# EAGLE design RadioIC (EAGLE 9.6.2)
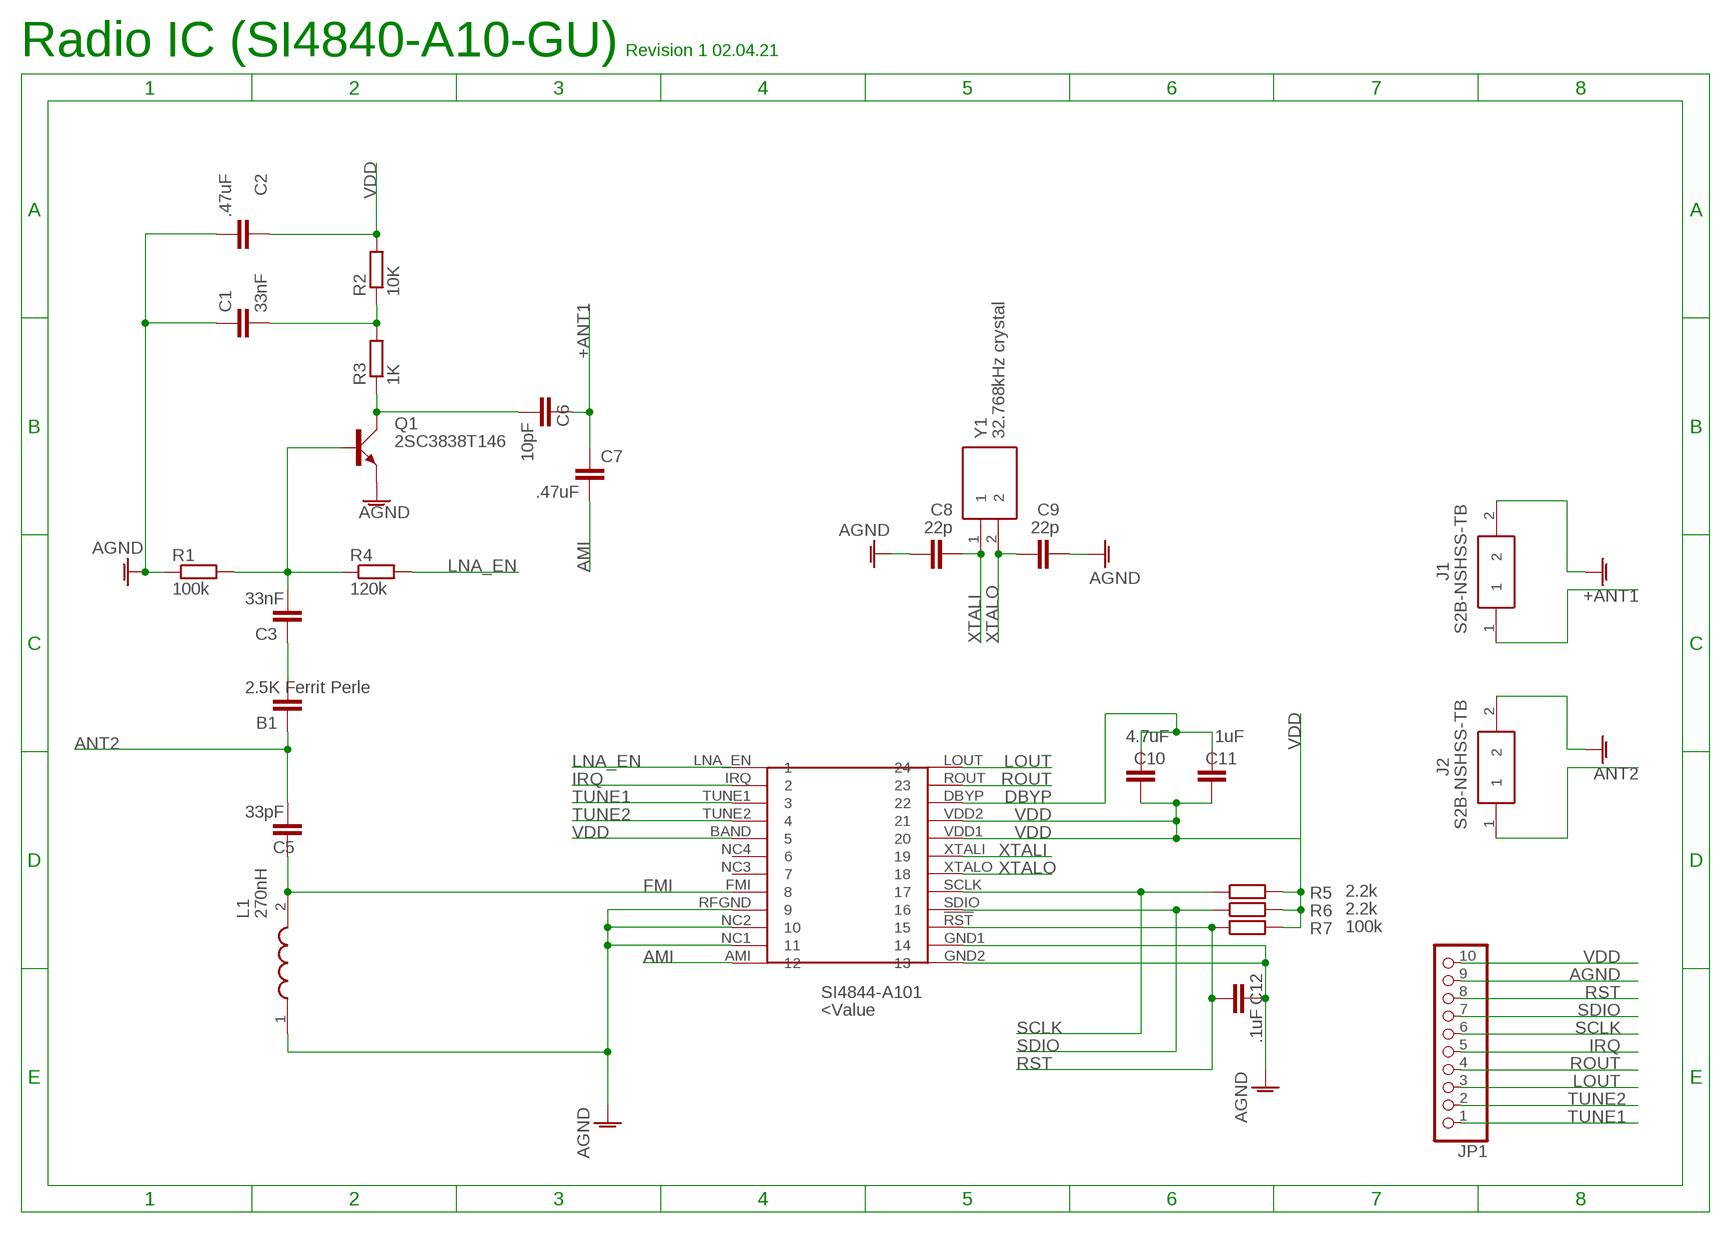
[diagram p0: schematic, sheet 1]

## Parts
B1  2.5K Ferrit Perle  C-EU_805C0805  [C0805]
C1  33nF  CNC5L1X7R1C106K160AEC1206  [C1206]
C2  .47uF  C-EU_805C0805  [C0805]
C3  33nF  C-EU_1206C1206  [C1206]
C5  33pF  C-EU_805C0805  [C0805]
C6  10pF  C-EU_805C0805  [C0805]
C7  .47uF  C-EU_805C0805  [C0805]
C8  22p  C-EU_805C0805  [C0805]
C9  22p  C-EU_805C0805  [C0805]
C10  4.7uF  C-EU_1206C1206  [C1206]
C11  1uF  C-EU_805C0805  [C0805]
C12  .1uF  C-EU_805C0805  [C0805]
J1  S2B-NSHSS-TB  [SM02B-NSHSS-TB]
J2  S2B-NSHSS-TB  [SM02B-NSHSS-TB]
JP1  PINHD-1X10  [1X10]
L1  270nH  LQW2UASR56F0CL  [LQW2UAS12NG00L]
Q1  2SC3838T146  [SC59]
R1  100k  ERJ-PB6B5623VR0805  [R0805]
R2  10K  RCS1206100KJNEAR1206  [R1206]
R3  1K  RCS1206100KJNEAR1206  [R1206]
R4  120k  ERJ-PB6B5623VR0805  [R0805]
R5  2.2k  ERJ-PB6B5623VR0805  [R0805]
R6  2.2k  ERJ-PB6B5623VR0805  [R0805]
R7  100k  ERJ-PB6B5623VR0805  [R0805]
SI4844-A101  SI4840-A10-GU  [SSOP]
Y1  32.768kHz crystal  CM7V-T1A-32.768K-9PF-20PPM-TA-  [CM7VT1A32768KHZ125PF10PPMTBQC]

## Nets
+ANT1: C6.1 C7.1 J1.1
AGND: C1.1 C2.2 C8.1 C9.2 C12.1 J1.2 J2.2 JP1.9 L1.1 Q1.E R1.1 SI4844-A101.GND1 SI4844-A101.GND2 SI4844-A101.NC1 SI4844-A101.NC2 SI4844-A101.RFGND
AMI: C7.2 SI4844-A101.AMI
ANT2: B1.1 C5.2 J2.1
DBYP: C10.2 C11.2 SI4844-A101.DBYP
FMI: C5.1 L1.2 SI4844-A101.FMI
IRQ: JP1.5 SI4844-A101.IRQ
LNA_EN: R4.2 SI4844-A101.LNA_EN
LOUT: JP1.3 SI4844-A101.LOUT
N$3: B1.2 C3.1
N$5: C3.2 Q1.B R1.2 R4.1
N$6: C6.2 Q1.C R3.1
N$7: C1.2 R2.1 R3.2
ROUT: JP1.4 SI4844-A101.ROUT
RST: C12.2 JP1.8 R7.1 SI4844-A101.!RST
SCLK: JP1.6 R5.1 SI4844-A101.SCLK
SDIO: JP1.7 R6.1 SI4844-A101.SDIO
TUNE1: JP1.1 SI4844-A101.TUNE1
TUNE2: JP1.2 SI4844-A101.TUNE2
VDD: C2.1 C10.1 C11.1 JP1.10 R2.2 R5.2 R6.2 R7.2 SI4844-A101.BAND SI4844-A101.VDD1 SI4844-A101.VDD2
XTALI: C8.2 SI4844-A101.XTALI Y1.1
XTALO: C9.1 SI4844-A101.XTALO Y1.2
Unconnected: SI4844-A101.NC3 SI4844-A101.NC4

## Notes on the sheet
- Radio IC (SI4840-A10-GU) | Revision 1 02.04.21

## Library data of the parts
B1 C2 C5-C9 C11 C12 = CommonParts:C-EU_805: CAPACITOR, European symbol; SPICEPREFIX: C
C1 = MouserUseful:CNC5L1X7R1C106K160AE: CAPACITOR, European symbol; MAX: 16V; SPICEPREFIX: C; VALUE: 10uF
C3 C10 = CommonParts:C-EU_1206: CAPACITOR, European symbol; SPICEPREFIX: C
J1 J2 = CommonParts:S2B-NSHSS-TB: NSH 1.0mm SMT shrouded R/A PCB header,2P JST NSH Series, 1mm Pitch 2 Way 1 Row Shrouded Right Angle PCB Header, Surface Mount, Solder Termination Source: Datasheet <http://www.jst-mfg.com/product/pdf/eng/eNSH.pdf>; DESCRIPTION: NSH 1.0mm SMT shrouded R/A PCB header,2P JST NSH Series, 1mm Pitch 2 Way 1 Row Shrouded Right Angle PCB Header, Surface Mount, Solder Termination; HEIGHT: mm; MANUFACTURER_NAME: JST (JAPAN SOLDERLESS TERMINALS); MANUFACTURER_PART_NUMBER: SM02B-NSHSS-TB(LF)(SN)
JP1 = pinhead:PINHD-1X10: PIN HEADER
L1 = MouserUseful:LQW2UASR56F0CL: LQW2UAS_0C Series Inductor 560nH +/-1% 1008 (2520) Source: Datasheet <https://componentsearchengine.com/Datasheets/1/LQW2UASR56F0CL.pdf>; DESCRIPTION: LQW2UAS_0C Series Inductor 560nH +/-1% 1008 (2520); HEIGHT: 2.03mm; MANUFACTURER_NAME: Murata Electronics; MANUFACTURER_PART_NUMBER: LQW2UASR56F0CL; MOUSER_PART_NUMBER: 81-LQW2UASR56F0CL; MOUSER_PRICE-STOCK: https://www.mouser.com/Search/Refine.aspx?Keyword=81-LQW2UASR56F0CL
Q1 = transistor-small-signal:2SC3838: High-Frequency Amplifier Transistor 11V, 50mA, 3.2GHz (Rohm)
R1 R4-R7 = MouserUseful:ERJ-PB6B5623V: RESISTOR, European symbol; VALUE: 562kOhm
R2 R3 = MouserUseful:RCS1206100KJNEA: RESISTOR, European symbol; SPICEPREFIX: R; VALUE: 100kOhm; WATT: 0.5
SI4844-A101 = MouserUseful:SI4840-A10-GU
Y1 = MouserUseful:CM7V-T1A-32.768K-9PF-20PPM-TA-: Crystals 32.768 kHz 9.0 pF +/-20 PPM AEC-Q200 Source: Datasheet <https://componentsearchengine.com/Datasheets/1/CM7V-T1A-32.768k-9pF-20PPM-TA-QA T3.pdf>; DESCRIPTION: Crystals 32.768 kHz 9.0 pF +/-20 PPM AEC-Q200; HEIGHT: 0.65mm; MANUFACTURER_NAME: MICRO CRYSTAL; MANUFACTURER_PART_NUMBER: CM7V-T1A-32.768k-9pF-20PPM-TA-QA T3; MOUSER_PART_NUMBER: 428-201568-MG03; MOUSER_PRICE-STOCK: https://www.mouser.com/Search/Refine.aspx?Keyword=428-201568-MG03

## Net classes
0 default: clearance 0.205 mm
1 other: width 0.2 mm, drill 0.2 mm, clearance 0.205 mm to class 0, clearance 0.205 mm

## Board
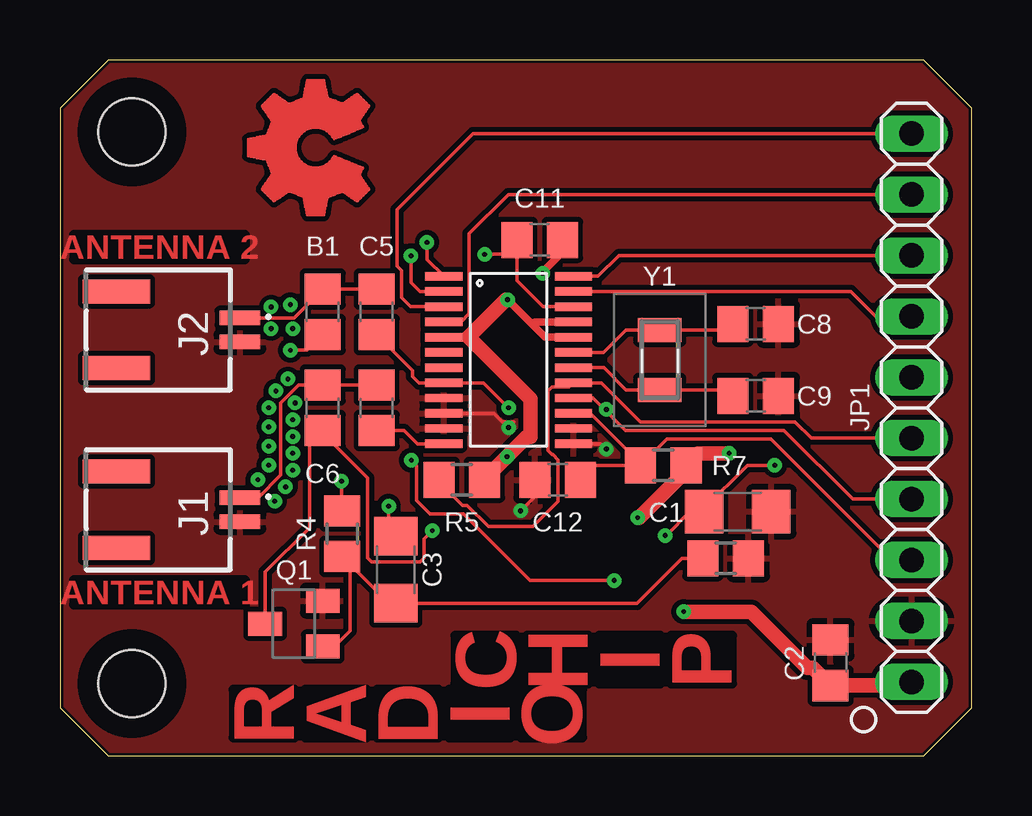
[diagram p1: board, top side]
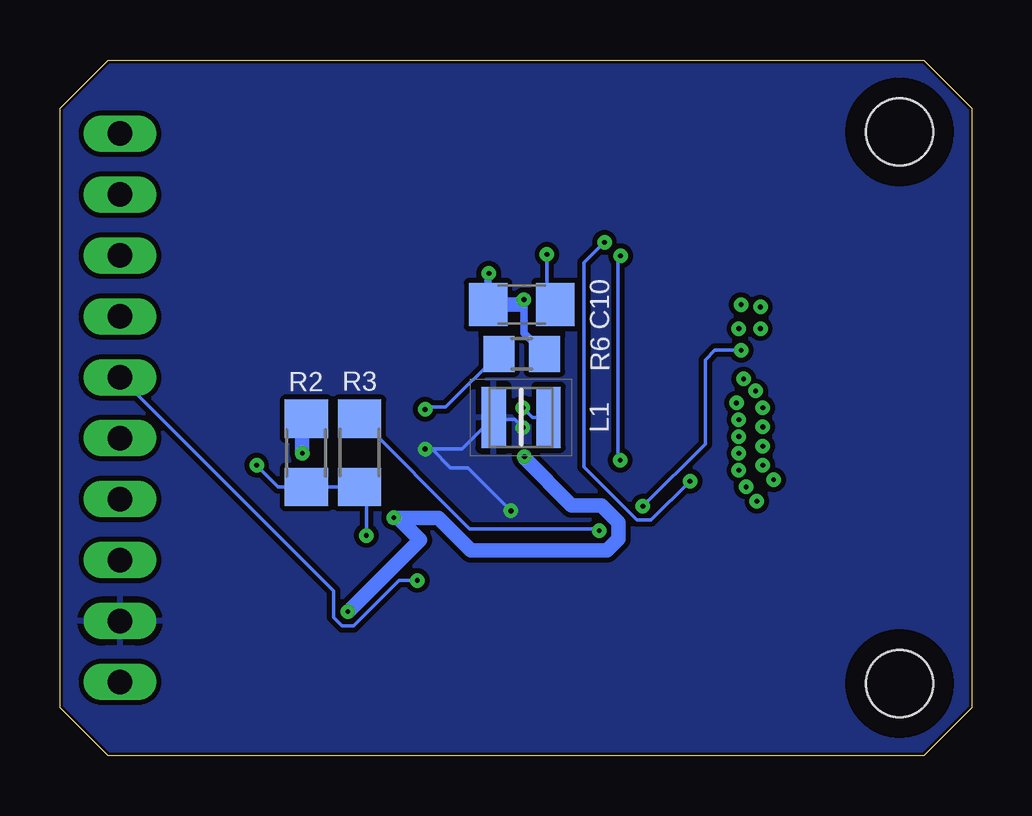
[diagram p2: board, bottom side, seen from below]

Size 38 x 29 mm. Coordinates in mm from the lower left corner, seen from the top.
Outline: 2,0 36,0 38,2 38,27 36,29 2,29 0,27 0,2 2,0
Copper layers (1*16): Top 0.035mm / dielectric 1.5mm / Bottom 0.035mm
Design rules "default *": minimum track width 6mil, minimum drill 0.2mm, track to track 6mil, track to pad 6mil, pad to pad 6mil, via to via 6mil, smd to smd 6mil, copper to edge 5mil, drill to drill 6mil, minimum pad ring 10mil, minimum via ring 8mil, stop-mask expansion 0mil, vias tented up to drill 0mil, thermal gap 10mil
Holes 2.8 mm at 3,3 3,26
tRestrict: area 2,25 to 4,27; area 2,2 to 4,4
bRestrict: area 2,2 to 4,4; area 2,25 to 4,27

### Footprints (pad centres in the part's own frame; a part is rotated, then mirrored left to right if it is on the bottom)
C0805 = smd 1.3 x 1.5: 1 -0.95,0; 2 0.95,0
C1206 = smd 1.6 x 1.8: 1 -1.4,0; 2 1.4,0
SM02B-NSHSS-TB = smd 0.6 x 1.7: 1 1,0; 2 0,0 | smd 1 x 2.8: 3 -1.1,5.15; 4 2.1,5.15
1X10 = drill 1.016 long: 1 -11.43,0; 2 -8.89,0; 3 -6.35,0; 4 -3.81,0; 5 -1.27,0; 6 1.27,0; 7 3.81,0; 8 6.35,0; 9 8.89,0; 10 11.43,0
LQW2UAS12NG00L = smd 1.015 x 2.54: 1 -1.143,0; 2 1.143,0
SC59 = smd 1 x 1.4: B -0.95,-1.2; C 0,1.2; E 0.95,-1.2
R0805 = smd 1.3 x 1.5: 1 -0.95,0; 2 0.95,0
R1206 = smd 1.6 x 1.803: 1 -1.422,0; 2 1.422,0
SSOP = smd 1.55 x 0.35: !RST 5.4,1.27; AMI 0,0; BAND 0,4.445; DBYP 5.4,5.715; FMI 0,2.54; GND1 5.4,0.635; GND2 5.4,0; IRQ 0,6.35; LNA_EN 0,6.985; LOUT 5.4,6.985; NC1 0,0.635; NC2 0,1.27; NC3 0,3.175; NC4 0,3.81; RFGND 0,1.905; ROUT 5.4,6.35; SCLK 5.4,2.54; SDIO 5.4,1.905; TUNE1 0,5.715; TUNE2 0,5.08; VDD1 5.4,4.445; VDD2 5.4,5.08; XTALI 5.4,3.81; XTALO 5.4,3.175
CM7VT1A32768KHZ125PF10PPMTBQC = smd 1 x 1.8: 1 -1.25,0; 2 1.25,0

### Placement (x,y rotation side)
B1  10.95,18.5 270 top
C1  28.25,10.17 180 top
C2  32.12,3.87 90 top
C3  14,7.75 270 top
C5  13.2,18.5 90 top
C6  10.95,14.5 270 top
C7  13.2,14.5 270 top
C8  29,18 180 top
C9  29,15 0 top
C10  18.75,18.8 0 bottom
C11  20,21.5 180 top
C12  20.75,11.5 0 top
J1  7.5,9.75 90 top
J2  7.5,17.25 90 top
JP1  35.5,14.5 270 top
L1  18.78,14.1 0 bottom
Q1  9.75,5.5 90 top
R1  27.75,8.22 180 top
R2  27.73,12.62 90 bottom
R3  25.51,12.62 270 bottom
R4  11.77,9.25 90 top
R5  16.75,11.5 0 top
R6  18.75,16.75 0 bottom
R7  25.15,12.1 0 top
SI4844-A101  16,13 0 top
Y1  25,16.5 270 top

### Tracks (layer width: path | path; a pad name or v marks a point on that pad's centre or on a via)
+ANT1
  Top 0.152: C7.1 C6.1 9.95,15.45 9.2,14.7 9.2,11.7 8.25,10.75 J1.1
AGND  (via drill 0.2 pad 0.35)
  Top 0.152: SI4844-A101.GND2 22.56,13 v22.78,12.78 | SI4844-A101.NC2 18.1,14.27 18.46,13.92 18.93,13.92 18.93,13.9 v18.7,13.67 | v19.2,10.2 19.8,10.8 C12.1
  Bottom 0.152: v22.78,12.78 22.5,12.78 | 22.5,12.78 21.25,12.78 20.01,14.01 | 20.01,14.01 L1.1 | v18.7,13.67 19.04,14.01 20.01,14.01 | v19.2,10.2 21,12 21.72,12 22.5,12.78
  pour Top: 0,2 0,27 2,29 36,29 38,27 38,2 36,0 2,0
  pour Bottom: 0,2 0,27 2,29 36,29 38,27 38,2 36,0 2,0
AMI
  Top 0.152: C7.2 14.35,13.55 14.9,13 SI4844-A101.AMI
ANT2
  Top 0.152: J2.1 9.75,18.25 B1.1 C5.2
DBYP  (via drill 0.2)
  Top 0.152: v17.7,20.9 18.45,20.9 C11.2 19.05,19.8 20.14,18.71 SI4844-A101.DBYP
  Bottom 0.152: v17.7,20.9 17.7,19.15 C10.2
FMI  (via drill 0.2)
  Top 0.152: C5.1 14.7,16.05 14.7,15.8 14.96,15.54 SI4844-A101.FMI 17.66,15.54 v18.7,14.5
  Bottom 0.152: L1.2 18.3,14.1 v18.7,14.5
IRQ  (via drill 0.2, 0.2 pad 0.35)
  Top 0.152: v14.64,12.31 14.87,12.08 14.87,10.63 15.43,10.07 16.83,10.07 19.6,7.3 v23.1,7.3 | v14.63,20.83 14.63,19.72 15,19.35 SI4844-A101.IRQ
  Bottom 0.152: v14.64,12.31 14.73,12.4 14.73,20.73 v14.63,20.83 | v23.1,7.3 23.87,7.3 25.76,5.41 26.24,5.41 26.59,5.76 26.59,6.86 JP1.5
LNA_EN  (via drill 0.2)
  Top 0.152: SI4844-A101.LNA_EN 15.3,20.68 v15.3,21.4 | R4.2 11.74,10.23 v11.74,11.44
  Bottom 0.152: v11.74,11.44 13.36,9.82 13.94,9.82 16.15,12.02 16.15,20.55 v15.3,21.4
LOUT
  Top 0.152: JP1.3 23.3,20.85 22.43,19.98 SI4844-A101.LOUT
N$1  (via drill 0.2 pad 0.35)
  other vias: 8.8,18.7
N$2  (via drill 0.2 pad 0.35)
  other vias: 9.6,18.8
N$3  (via drill 0.2)
  Top 0.152: C3.1 13.7,9.45 v13.7,10.4 | B1.2 10.3,16.9 v9.6,16.9
  Bottom 0.152: v13.7,10.4 11.1,13 11.1,16.5 10.7,16.9 v9.6,16.9
N$4  (via drill 0.2 pad 0.35)
  other vias: 9.7,17.8
N$5
  Top 0.152: R1.2 25.92,8.22 24.05,6.35 C3.2 13.72,6.35 R4.1 12.1,7.97 12.1,5.2 11.45,4.55 Q1.B
N$6  (via drill 0.2)
  Top 0.152: Q1.C 8.55,7.65 10.4,9.5 10.4,13 10.9,13.5 | 10.9,13.5 C6.2 | v15.53,9.38 15.18,9.03 15.18,8.23 15.02,8.07 12.98,8.07 12.82,8.23 12.82,11.58 10.9,13.5
  Bottom 0.152: R3.1 20.92,9.45 15.6,9.45 v15.53,9.38
N$7  (via drill 0.2)
  Top 0.152: v29.8,12.1 28.65,12.1 26.85,10.3 C1.2 26.27,10.17 25.25,9.15 v25.23,9.18
  Bottom 0.152: v29.8,12.1 28.9,11.2 R2.1 25.55,11.2 | 25.55,11.2 R3.2 | v25.23,9.18 25.23,10.87 25.55,11.2
N$8  (via drill 0.2 pad 0.35)
  other vias: 8.8,17.8
N$9  (via drill 0.2 pad 0.35)
  other vias: 8.7,12.1
N$10  (via drill 0.2 pad 0.35)
  other vias: 8.7,12.9
N$11  (via drill 0.2 pad 0.35)
  other vias: 8.7,13.7
N$12  (via drill 0.2 pad 0.35)
  other vias: 8.7,14.5
N$13  (via drill 0.2 pad 0.35)
  other vias: 9,15.2
N$14  (via drill 0.2 pad 0.35)
  other vias: 9.5,15.7
N$15  (via drill 0.2 pad 0.35)
  other vias: 9.8,14.7
N$16  (via drill 0.2 pad 0.35)
  other vias: 9.7,14
N$17  (via drill 0.2 pad 0.35)
  other vias: 9.7,13.3
N$18  (via drill 0.2 pad 0.35)
  other vias: 9.7,12.6
N$19  (via drill 0.2 pad 0.35)
  other vias: 9.7,11.9
N$20  (via drill 0.2 pad 0.35)
  other vias: 9.4,11.2
N$21  (via drill 0.2 pad 0.35)
  other vias: 8.95,10.6
N$22  (via drill 0.2 pad 0.35)
  other vias: 8.25,11.5
ROUT
  Top 0.152: JP1.4 34,18.31 32.96,19.35 SI4844-A101.ROUT
RST
  Top 0.152: JP1.8 34.69,8.15 29.64,13.2 25.3,13.2 R7.1 | R7.1 24.2,12.18 22.11,14.27 SI4844-A101.!RST | C12.2 22.3,12.1 R7.1
SCLK
  Top 0.152: JP1.6 31.32,13.23 30.63,13.91 24.19,13.91 22.57,15.54 SI4844-A101.SCLK 21.22,15.36 20.51,15.36 20.34,15.2 20.34,12.71 20.51,12.54 20.55,12.54 20.77,12.33 20.77,10.6 19.71,9.55 17.86,9.55 16.98,10.43 16.77,10.43 16,11.2 16,11.5 R5.1
SDIO  (via drill 0.2)
  Top 0.152: SI4844-A101.SDIO 22.23,14.9 22.79,14.34 | 22.79,14.34 23.57,13.56 30.18,13.56 33.05,10.69 JP1.7 | v22.78,14.43 v22.79,14.42 22.79,14.34
  Bottom 0.152: R6.1 21.92,14.53 22.68,14.53 v22.78,14.43
TUNE1
  Top 0.152: JP1.1 17.23,25.93 14.05,22.75 14.05,20.4 14.23,20.22 14.23,19.1 14.62,18.71 SI4844-A101.TUNE1 15.99,18.73
TUNE2
  Top 0.152: SI4844-A101.TUNE2 16.71,18.08 17.06,18.42 17.06,21.76 18.69,23.39 JP1.2
VDD  (via drill 0.2 pad 0.35)
  Top 0.152: v18.66,19 19.58,18.08 19.8,18.08 | 21.3,18.08 SI4844-A101.VDD2
  Top 0.305: 17.04,17.45 SI4844-A101.BAND | v18.66,19 20.22,17.45 SI4844-A101.VDD1 | 19.8,18.08 21.3,18.08 | v20.12,20.1 20.27,20.25 20.27,20.31 20.95,20.99 C11.1
  Top 0.61: JP1.10 35.35,2.92 C2.1 31.38,3.66 31.16,3.66 28.82,6 v26,6 | v24.09,9.91 24.14,9.91 26.1,11.88 R7.2 26.6,12.6 v27.9,12.6 | v18.66,19 18.59,19 17.04,17.45 19.61,14.87 19.61,13.27 19.45,13.27 v18.64,12.46 17.7,11.52 R5.2
  Bottom 0.305: R6.2 18.66,17.61 v18.66,19 | v20.12,20.1 20.15,20.07 C10.1
  Bottom 0.61: v26,6 23,9 23.91,9.91 | 23.91,9.91 v24.09,9.91 | v27.9,12.6 27.9,13.87 R2.2 | v18.66,19 18.86,18.8 C10.1 | 23.91,9.91 22.21,9.91 20.86,8.56 15.19,8.56 14.71,9.04 14.71,9.71 15.44,10.44 16.68,10.44 18.64,12.4 v18.64,12.46
XTALI
  Top 0.152: SI4844-A101.XTALI 22.66,16.81 23.6,17.75 Y1.1 27.8,17.75 C8.2
XTALO
  Top 0.152: SI4844-A101.XTALO 22.68,16.18 23.6,15.25 Y1.2 27.8,15.25 C9.1
(copper drawn outside any net)
  shapes: Top area x369

### Text on the board
Top: ANTENNA 2 | ANTENNA 1 | C | H | I | P | R | A | D | I | O
tStop: ANTENNA 2 | ANTENNA 1 | C | H | I | P | R | A | D | I | O